# Altium schematic sheet Tester Harness with Terminations.SchDoc
size A4
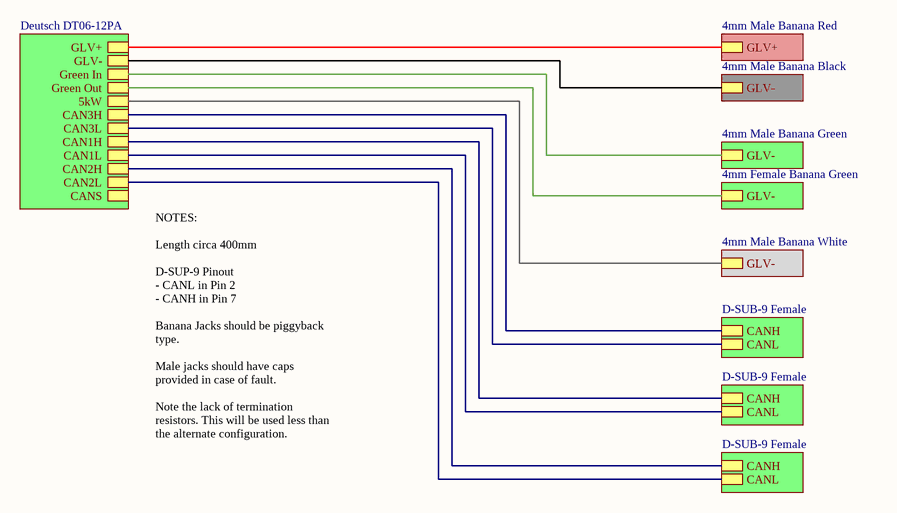
[diagram p0: Tester Harness with Terminations.SchDoc]

## Sub-sheets
4mm Female Banana Green = File Name: GLV-
4mm Male Banana Black = File Name: GLV-
4mm Male Banana Green = File Name: GLV-
4mm Male Banana Red = File Name: GLV+
4mm Male Banana White = File Name: GLV-
D-SUB-9 Female = File Name: CANH, CANL
D-SUB-9 Female = File Name: CANH, CANL
D-SUB-9 Female = File Name: CANH, CANL
Deutsch DT06-12PA = File Name: GLV+, GLV-, CAN1H, CAN3H, CAN3L, CAN2H, CAN1L, CAN2L, CANS, Green Out, Green In, 5kW

## Nets
(unnamed): sheet Deutsch DT06-12PA/GLV+, sheet 4mm Male Banana Red/GLV+
(unnamed): sheet Deutsch DT06-12PA/GLV-, sheet 4mm Male Banana Black/GLV-
(unnamed): sheet Deutsch DT06-12PA/CAN1H, sheet D-SUB-9 Female/CANH
(unnamed): sheet Deutsch DT06-12PA/CAN3H, sheet D-SUB-9 Female/CANH
(unnamed): sheet Deutsch DT06-12PA/CAN3L, sheet D-SUB-9 Female/CANL
(unnamed): sheet Deutsch DT06-12PA/CAN2H, sheet D-SUB-9 Female/CANH
(unnamed): sheet Deutsch DT06-12PA/CAN1L, sheet D-SUB-9 Female/CANL
(unnamed): sheet Deutsch DT06-12PA/CAN2L, sheet D-SUB-9 Female/CANL
(unnamed): sheet Deutsch DT06-12PA/Green Out, sheet 4mm Female Banana Green/GLV-
(unnamed): sheet Deutsch DT06-12PA/Green In, sheet 4mm Male Banana Green/GLV-
(unnamed): sheet Deutsch DT06-12PA/5kW, sheet 4mm Male Banana White/GLV-

## Notes on the sheet
- NOTES:
  Length circa 400mm
  D-SUP-9 Pinout
  - CANL in Pin 2
  - CANH in Pin 7
  Banana Jacks should be piggyback type.
  Male jacks should have caps provided in case of fault.
  Note the lack of termination resistors. This will be used less than the alternate configuration.